# EAGLE design roco1044 (EAGLE 9.5.2)
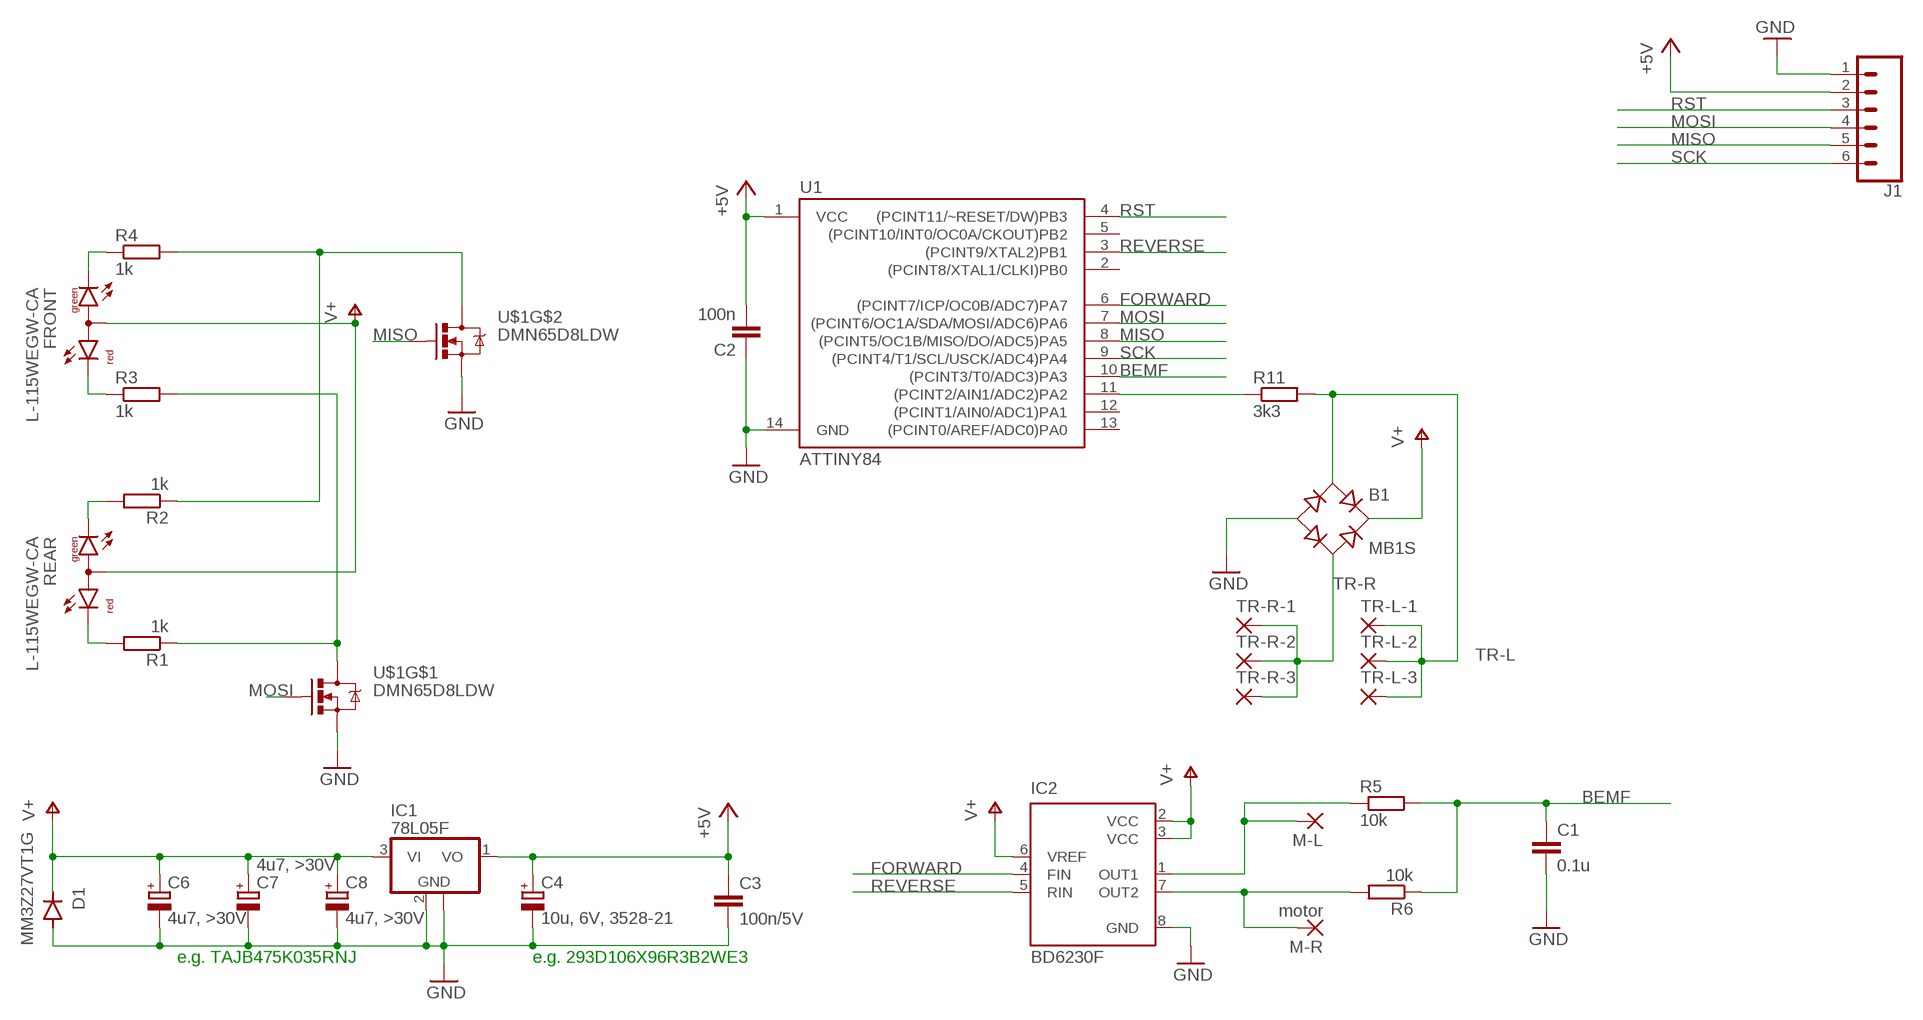
[diagram p0: schematic, sheet 1]

## Parts
B1  MB1S  [SOIC-4]
C1  0.1u  C-EUC0805  [C0805]
C2  100n  C-EUC0805  [C0805]
C3  100n/5V  C-EUC0805  [C0805]
C4  10u, 6V, 3528-21  CPOL-EUCT3528  [CT3528]
C6  4u7, >30V  CPOL-EUCT3528  [CT3528]
C7  4u7, >30V  CPOL-EUCT3528  [CT3528]
C8  4u7, >30V  CPOL-EUCT3528  [CT3528]
D1  MM3Z27VT1G  DIODE-SOD323-R  [SOD323-R]
FRONT  L-115WEGW-CA  [DUOLED-A-3MM]
IC1  78L05F  [SOT89]
IC2  BD6230F  [SOP8]
J1  CONN_061.27MM  [1X06_1.27MM]
M-L  SMD5  [SMD2,54-5,08]
M-R  motor  SMD5  [SMD2,54-5,08]
R1  1k  R-EU_R0603  [R0603]
R2  1k  R-EU_R0603  [R0603]
R3  1k  R-EU_R0603  [R0603]
R4  1k  R-EU_R0603  [R0603]
R5  10k  R-EU_R0603  [R0603]
R6  10k  R-EU_R0603  [R0603]
R11  3k3  R-EU_R0603  [R0603]
REAR  L-115WEGW-CA  [DUOLED-A-3MM]
TR-L-1  SMD5  [SMD2,54-5,08]
TR-L-2  SMD5  [SMD2,54-5,08]
TR-L-3  SMD5  [SMD2,54-5,08]
TR-R-1  SMD5  [SMD2,54-5,08]
TR-R-2  SMD5  [SMD2,54-5,08]
TR-R-3  SMD5  [SMD2,54-5,08]
U1  ATTINY84  [SO14]
U$1  DMN65D8LDW  [SOT363]

## Nets
+5V: C2.2 C3.1 C4.+ IC1.1(VO) J1.2 U1.1(VCC)
BEMF: C1.1 R5.2 R6.1 U1.10((PCINT3/T0/ADC3)PA3)
FORWARD: IC2.4(FIN) U1.6((PCINT7/ICP/OC0B/ADC7)PA7)
GND: B1.- C1.2 C2.1 C3.2 C4.- C6.- C7.- C8.- D1.A IC1.2(GND) IC1.2@1(GND) IC2.8(GND) J1.1 U1.14(GND) U$1.P$3(S) U$1.P$6(S)
MISO: J1.5 U1.8((PCINT5/OC1B/MISO/DO/ADC5)PA5) U$1.P$5(G)
MOSI: J1.4 U1.7((PCINT6/OC1A/SDA/MOSI/ADC6)PA6) U$1.P$2(G)
N$4: IC2.7(OUT2) M-R.1(P) R6.2
N$5: R2.1 R4.2 U$1.P$1(D)
N$6: R1.2 REAR.3(CR)
N$7: R2.2 REAR.1(CG)
N$8: R1.1 R3.2 U$1.P$4(D)
N$9: FRONT.3(CR) R3.1
N$10: FRONT.1(CG) R4.1
N$11: IC2.1(OUT1) M-L.1(P) R5.1
N$12: R11.1 U1.11((PCINT2/AIN1/ADC2)PA2)
REVERSE: IC2.5(RIN) U1.3((PCINT9/XTAL2)PB1)
RST: J1.3 U1.4((PCINT11/~RESET/DW)PB3)
SCK: J1.6 U1.9((PCINT4/T1/SCL/USCK/ADC4)PA4)
TR-L: B1.~1(AC1) R11.2 TR-L-1.1(P) TR-L-2.1(P) TR-L-3.1(P)
TR-R: B1.~2(AC2) TR-R-1.1(P) TR-R-2.1(P) TR-R-3.1(P)
V+: B1.+ C6.+ C7.+ C8.+ D1.C FRONT.2(A) IC1.3(VI) IC2.2(VCC) IC2.3(VCC) IC2.6(VREF) REAR.2(A)
Unconnected: U1.2((PCINT8/XTAL1/CLKI)PB0) U1.5((PCINT10/INT0/OC0A/CKOUT)PB2) U1.12((PCINT1/AIN0/ADC1)PA1) U1.13((PCINT0/AREF/ADC0)PA0)

## Notes on the sheet
- e.g. TAJB475K035RNJ | e.g. 293D106X96R3B2WE3

## Library data of the parts
B1 = rectifier:MB*S: Bridge Rectifier Source: http://www.fairchildsemi.com/ds/MB/MB6S.pdf
C1 = resistor:C-EU: CAPACITOR, European symbol
C2 C3 = rcl:C-EU: CAPACITOR, European symbol; SPICEPREFIX: C
C4 C6-C8 = rcl:CPOL-EU: POLARIZED CAPACITOR, European symbol; SPICEPREFIX: C
D1 = diode:DIODE-: DIODE
FRONT REAR = led:L-115WEGW-CA: T-1(3mm) BI-COLOR INDICATOR LAMP Source: Kingbright .. 2_colour_led_.pdf
IC1 = linear:78L*: POSITOIV-VOLTAGE REGULATORS Output up to 100 mA Source: Datasheet <http://focus.ti.com/lit/ds/symlink/ua78l05.pdf>
IC2 = rohm:BD623*F: H-bridge driver for brush motors Source: http://www.rohm.com/products/databook/motor/pdf/bd623x_series-e.pdf; MPN: BD6230F-E2; OC_FARNELL: 1716264; OC_NEWARK: 15R0529
J1 = SparkFun-Connectors:CONN_06: Multi connection point. Often used as Generic Header-pin footprint for 0.1 inch spaced/style header connections On any of the 0.1 inch spaced packages, you can populate with these: Break Away Headers - Straight <https://www.sparkfun.com/products/116> (PRT-00116) Break Away Male Headers - Right Angle <https://www.sparkfun.com/products/553> (PRT-00553) Female Headers <https://www.sparkfun.com/products/115> (PRT-00115) Break Away Headers - Machine Pin <https://www.sparkfun.com/products/117> (PRT-00117) Break Away Female Headers - Swiss Machine Pin <https://www.sparkfun.com/products/743> (PRT-00743) Arduino Stackable Header - 6 Pin <https://www.sparkfun.com/products/9280> (PRT-09280) For SCREWTERMINALS and SPRING TERMINALS visit here: Screw Terimnals on SparkFun.com <https://www.sparkfun.com/search/results?term=Screw+Terminals> (5mm/3.5mm/2.54mm spacing) This device is also useful as a general connection point to wire up your design to another part of your project. Our various solder wires solder well into these plated through hole pads. Hook-Up Wire - Assortment (Stranded, 22 AWG) <https://www.sparkfun.com/products/11375> (PRT-11375) Hook-Up Wire - Assortment (Solid Core, 22 AWG) <https://www.sparkfun.com/products/11367> (PRT-11367) View the entire wire category on our website here <https://www.sparkfun.com/categories/141>
M-L M-R TR-L-1-TR-L-3 TR-R-1-TR-R-3 = wirepad:SMD5: SMD PAD
R1-R6 R11 = rcl:R-EU_: RESISTOR, European symbol; SPICEPREFIX: R
U1 = SparkFun-IC-Microcontroller:ATTINY84: Atmel 14-pin 2/4/8kB flash uC Datasheet <https://cdn.sparkfun.com/datasheets/Widgets/doc8006.pdf> SparkFun Products Tiny AVR Programmer <https://www.sparkfun.com/products/11801> (PGM-11801) SparkFun Servo Trigger - Continuous Rotation <https://www.sparkfun.com/products/13872> (WIG-13872) SparkFun Servo Trigger <https://www.sparkfun.com/products/13118> (WIG-13118); PROD_ID: IC-11285
U$1 = Railstars:DMN65D8LDW

## Board
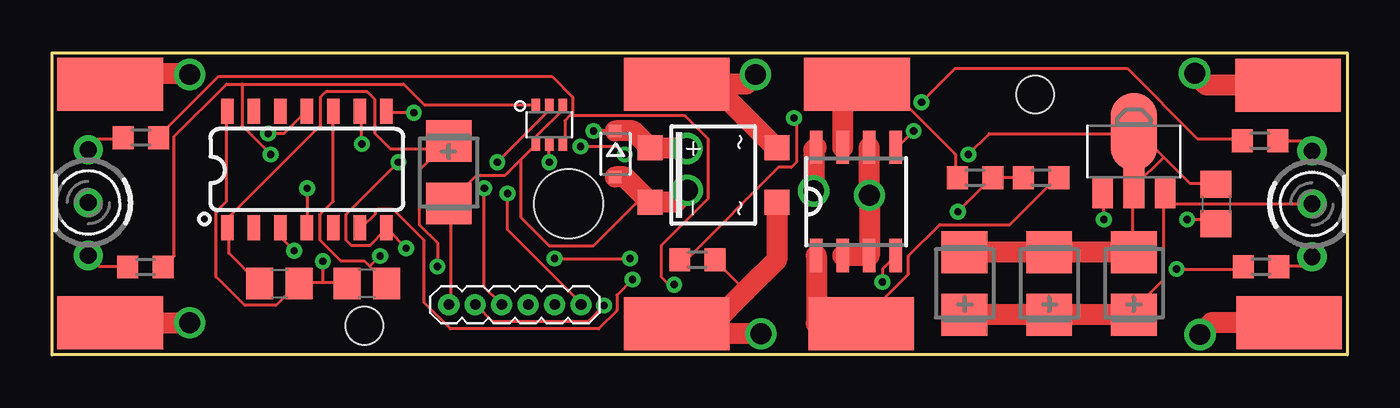
[diagram p1: board, top side]
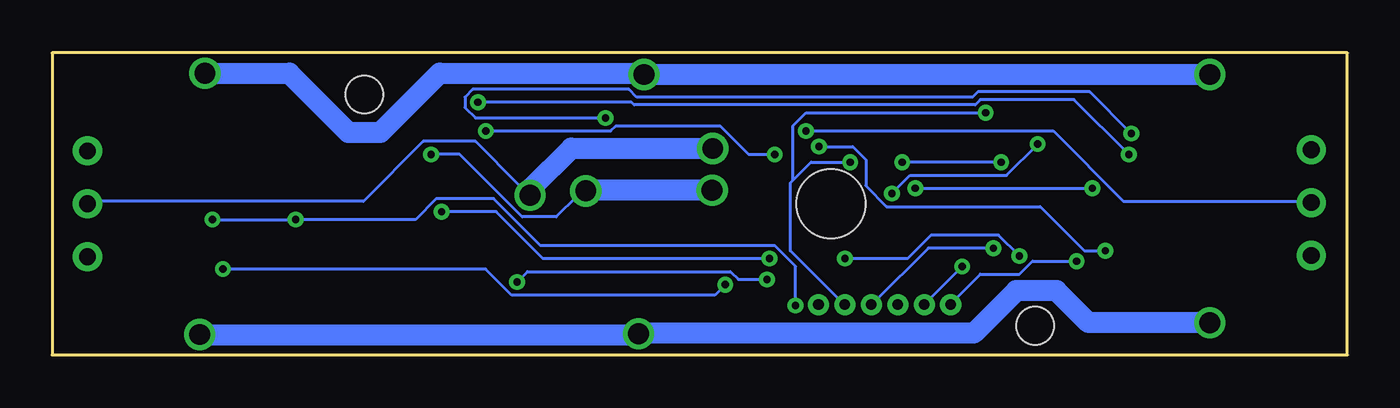
[diagram p2: board, bottom side, seen from below]

Size 62.2 x 14.5 mm. Coordinates in mm from the lower left corner, seen from the top.
Outline: 0,0 0,14.5 62.2,14.5 62.2,0 0,0
Copper layers (1*16): Top 0.035mm / dielectric 1.5mm / Bottom 0.035mm
Design rules "default *": minimum track width 6mil, minimum drill 0.3mm, track to track 6mil, track to pad 6mil, pad to pad 6mil, via to via 6mil, smd to smd 6mil, copper to edge 6mil, drill to drill 6mil, minimum pad ring 10mil, minimum via ring 8mil, stop-mask expansion 4mil, vias tented up to drill 0mil, thermal gap 10mil
Holes 1.8 mm at 15,1.4 47.2,12.5
Holes 3.3 mm at 24.8,7.25

### Footprints (pad centres in the part's own frame; a part is rotated, then mirrored left to right if it is on the bottom)
SOIC-4 = smd 1.2 x 1.2: + 1.3,3.05; - -1.3,3.05; ~1 -1.3,-3.05; ~2 1.3,-3.05
C0805 = smd 1.3 x 1.5: 1 -0.95,0; 2 0.95,0
CT3528 = smd 2 x 2.2: + -1.5,0; - 1.5,0
SOD323-R = smd 0.6 x 0.6: A 1.1,0; C -1.1,0
DUOLED-A-3MM = drill 0.8 pad 1.4: 1 -2.54,0; 2 0,0; 3 2.54,0
SOT89 = smd 1 x 1.5: 1 -1.499,-1.981; 3 1.499,-1.981 | smd 1 x 2: 2 0,-1.727 | smd 2.2 x 3.7: 2@1 0,0.94
SOP8 = smd 0.6 x 1.6: 1 -1.905,-2.6; 2 -0.635,-2.6; 3 0.635,-2.6; 4 1.905,-2.6; 5 1.905,2.6; 6 0.635,2.6; 7 -0.635,2.6; 8 -1.905,2.6
1X06_1.27MM = drill 0.508 pad 1: 1 0,0; 2 1.27,0; 3 2.54,0; 4 3.81,0; 5 5.08,0; 6 6.35,0
SMD2,54-5,08 = smd 2.54 x 5.08: 1 0,0
R0603 = smd 1 x 1.1: 1 -0.85,0; 2 0.85,0
SO14 = smd 0.6 x 1.2: 1 -3.175,-2.8; 2 -1.905,-2.8; 3 -0.635,-2.8; 4 0.635,-2.8; 5 1.905,-2.8; 6 3.175,-2.8; 7 4.445,-2.8; 8 4.445,2.8; 9 3.175,2.8; 10 1.905,2.8; 11 0.635,2.8; 12 -0.635,2.8; 13 -1.905,2.8; 14 -3.175,2.8
SOT363 = smd 0.42 x 0.6: P$1 -0.65,0.95; P$2 0,0.95; P$3 0.65,0.95; P$4 0.65,-0.95; P$5 0,-0.95; P$6 -0.65,-0.95

### Placement (x,y rotation side)
B1  31.75,8.64 90 top
C1  15.11,3.43 180 top
C2  55.88,7.24 270 top
C3  10.92,3.43 0 top
C4  19.05,8.76 270 top
C6  43.81,3.43 90 top
C7  47.88,3.43 90 top
C8  51.94,3.43 90 top
D1  27.05,9.65 270 top
FRONT  1.74,7.31 90 top
IC1  51.94,9.78 0 top
IC2  38.61,7.37 0 top
J1  19.05,2.41 0 top
M-L  38.85,1.5 90 top
M-R  38.65,13 90 top
R1  58.05,4.23 0 top
R2  58.01,10.28 0 top
R3  4.27,10.43 0 top
R4  4.48,4.22 0 top
R5  47.5,8.51 180 top
R6  44.32,8.51 180 top
R11  30.99,4.57 0 top
REAR  60.5,7.25 270 top
TR-L-1  2.8,1.55 90 top
TR-L-2  59.4,1.55 90 top
TR-L-3  30,1.5 270 top
TR-R-1  2.8,13 90 top
TR-R-2  59.35,12.95 270 top
TR-R-3  30,13 90 top
U1  11.6,8.9 0 top
U$1  23.88,11.05 0 top

### Tracks (layer width: path | path; a pad name or v marks a point on that pad's centre or on a via)
+5V  (via drill 0.35)
  Top 0.152: v50.5,6.5 50.5,7.75 IC1.1 | v54.5,6.5 55.75,6.5 55.88,6.38 C2.2 | C3.1 9.88,3.5 8.5,4.88 8.5,6 U1.1 8.5,6.12 8.5,6.62 12.88,11 12.88,12.38 13.12,12.62 15.12,12.62 15.5,12.25 15.5,10.62 16.24,9.88 18.62,9.88 | v18.5,4.25 18.5,5.38 17.62,6.25 17.62,8.88 18.62,9.88 | 18.62,9.88 19,10.25 C4.+ 18.62,9.88 | v26.5,2.38 25.75,1.62 21.12,1.62 20.38,2.38 J1.2
  Bottom 0.152: v54.5,6.5 v50.5,6.5 44.75,6.5 43.75,7.5 41,7.5 38.75,5.25 27.5,5.25 26.5,4.25 v26.5,2.38 | v18.5,4.25 20.25,2.5 J1.2
BEMF  (via drill 0.35)
  Top 0.152: R5.2 46.62,8.5 45.25,8.5 R6.1 45.12,8.5 v43.5,6.88 | 15.25,4.25 16,3.5 C1.1 | 15.25,4.25 15,4.5 13.88,4.5 12.88,5.5 12.88,6.75 13.5,7.38 13.5,11.62 U1.10 | v24.12,4.62 v27.75,4.62 | 15.25,4.25 v15.75,4.75
  Bottom 0.152: v43.5,6.88 40.88,6.88 38.62,4.62 v27.75,4.62 | v24.12,4.62 21.12,4.62 20,5.75 16.75,5.75 v15.75,4.75
FORWARD  (via drill 0.35)
  Top 0.152: v27.88,3.62 27.12,2.88 27.12,2.12 26.25,1.25 19.12,1.25 17.88,2.5 17.88,5.5 16.38,7 15.62,7 15.5,6.88 15.5,6.75 14.88,6.12 U1.6 | v39.88,3.5 39.88,4.12 40.5,4.75 IC2.4
  Bottom 0.152: v27.88,3.62 29.25,3.62 29.62,4 39.38,4 v39.88,3.5
GND  (via drill 0.35, 1)
  Top 0.152: U1.14 8.38,11.62 8.38,7.38 7.88,6.88 7.88,3.75 9.25,2.38 10.75,2.38 11.75,3.38 C3.2 11.88,3.5 13,3.5 | 13,3.5 14.12,3.5 C1.2 | 53.38,9.5 52.25,10.62 52,10.62 IC1.2@1 51.88,10.62 45,10.62 v44,9.62 | 53.38,9.5 54.62,8.25 55.88,8.25 C2.1 | 53.38,9.5 52,8.12 IC1.2 51.88,8 51.88,5.38 C8.- | U$1.P$3 24.62,11.88 23.25,10.5 23.25,10.12 U$1.P$6 23.12,10 22.5,9.38 | 22.5,9.38 21.75,8.62 20.38,8.62 19.12,7.38 C4.- 19.12,7.25 19.12,2.5 J1.1 | 28.4,7.64 26.01,5.25 23.87,5.25 22.5,6.62 22.5,9.38 | v13,4.5 13,3.5
  Top 1.016: IC2.8 36.58,9.84 v36.58,7.87 | v30.5,7.9 29.94,7.34 B1.- 28.4,7.64 27.48,8.55 D1.A | C8.- C7.- C6.-
  Bottom 0.152: v44,9.62 42.62,9.62 39.62,6.62 38,6.62 37,7.62 v36.58,7.87 | v13,4.5 15.12,4.5 15.75,3.88 17.62,3.88 19,2.5 J1.1
  Bottom 1.016: v30.5,7.9 30.53,7.92 36.52,7.92 v36.58,7.87
MISO  (via drill 0.35)
  Top 0.152: v23.88,9.25 23.88,10 U$1.P$5 | v17.38,11.62 16.12,11.62 U1.8
  Bottom 0.152: v23.88,9.25 25.75,9.25 26.62,8.38 | 26.62,8.38 26.75,8.25 26.75,5 24.25,2.5 J1.5 | v17.38,11.62 26,11.62 26.62,11 26.62,8.38
MOSI  (via drill 0.35)
  Top 0.152: v21.38,9.25 23.88,11.75 23.88,11.88 U$1.P$2 | v16.62,9.25 14.12,6.75 14.12,5.5 14.38,5.25 15.25,5.25 16,6 U1.7 16.12,6 v17,5.12
  Bottom 0.152: v16.62,9.25 v21.38,9.25 | v17,5.12 20.12,5.12 22.75,2.5 J1.4
N$4
  Top 0.152: R6.2 43.38,8.62 43.38,9.62 40.12,12.88 39.12,12.88 M-R.1
  Top 1.016: IC2.7 37.97,12.95 38.02,13 M-R.1
N$5  (via drill 0.35)
  Top 0.152: 9.12,13 8.38,13 5.88,10.5 5.88,4.75 5.38,4.25 R4.2 | 9.12,13 16.88,13 17.88,12 23.12,12 U$1.P$1 | v41.75,12.12 43.38,13.75 51.62,13.75 55,10.38 57.12,10.38 R2.1 | v10.5,9.62 9.12,11 9.12,13
  Bottom 0.152: v41.75,12.12 34.38,12.12 34.25,12 17.88,12 17.62,12.25 13.12,12.25 v10.5,9.62
N$6
  Top 0.152: R1.2 59,4.25 60.12,4.25 60.5,4.62 REAR.3
N$7
  Top 0.152: R2.2 58.88,10.25 60.12,10.25 60.5,9.88 REAR.1
N$8  (via drill 0.35)
  Top 0.152: 24.88,11.5 25,11.62 25,12.38 24,13.38 8,13.38 5.12,10.5 R3.2 | 24.88,11.5 24.62,11.25 24.62,10.12 U$1.P$4 | v54,4.12 57.12,4.12 R1.1 | v29.88,3.38 29.62,3.38 29.25,3.75 29.25,5.25 31.5,7.5 31.5,10.38 30.38,11.5 24.88,11.5
  Bottom 0.152: v54,4.12 41.38,4.12 40.12,2.88 30.38,2.88 v29.88,3.38
N$9
  Top 0.152: R3.1 3.38,10.38 2.25,10.38 1.75,9.88 FRONT.3
N$10
  Top 0.152: R4.1 3.62,4.25 2.25,4.25 1.75,4.75 FRONT.1
N$11
  Top 0.152: R5.1 48.25,8.5 46,6.25 42.62,6.25 41.12,4.75 41.12,3.88 39.12,1.88 M-L.1
  Top 1.016: IC2.1 36.7,1.5 M-L.1
N$12  (via drill 0.35)
  Top 0.152: v35.62,11.38 35.75,11.25 35.75,9.25 35.5,9 34.88,9 30.5,4.62 30.25,4.62 R11.1 | v10.38,10.62 11.12,10.62 12.12,11.62 U1.11
  Bottom 0.152: v35.62,11.38 41.88,11.38 42.38,11.88 42.38,12.38 42,12.75 34.5,12.75 34.12,12.38 18,12.38 17.75,12.62 12.38,12.62 v10.38,10.62
REVERSE  (via drill 0.35)
  Top 0.152: v11.62,5 11,5.62 11,6 U1.3 | v25.38,10 27.12,10 v27.5,9.62 | v41.38,10.75 40.62,10 IC2.5
  Bottom 0.152: v11.62,5 12.62,5 14.75,7.12 22.12,7.12 23.12,8.12 23.12,9.38 23.75,10 v25.38,10 | v27.5,9.62 28.75,9.62 30.12,11 35.12,11 35.38,10.75 v41.38,10.75
RST  (via drill 0.35)
  Top 0.152: v12.25,8 12.25,6.12 U1.4 | v20.75,8 20.75,3.25 21.5,2.5 J1.3
  Bottom 0.152: v20.75,8 v12.25,8
SCK  (via drill 0.35)
  Top 0.152: v14.88,10.12 14.88,11.62 U1.9 | v21.88,7.75 21.88,6 25.38,2.5 J1.6
  Bottom 0.152: v14.88,10.12 16.38,8.62 21,8.62 v21.88,7.75
TR-L  (via drill 1)
  Top 0.152: 33.3,3.07 31.88,4.5 R11.2
  Top 1.016: B1.~1 34.8,4.57 33.3,3.07 31.73,1.5 TR-L-3.1 30.48,1.02 v34.04,1.02 | v55.12,0.98 55.69,1.55 TR-L-2.1 | TR-L-1.1 v6.6,1.55
  Bottom 1.016: v55.12,0.98 34.04,0.98 | 34.04,0.98 v34.04,1.02 | v6.6,1.55 12.44,1.55 13.97,3.09 15.9,3.09 17.95,1.04 33.97,1.04 34.04,0.98
TR-R  (via drill 1)
  Top 1.016: B1.~2 34.77,9.94 31.7,13 TR-R-3.1 33.32,13 v33.78,13.46 | v54.86,13.52 55.44,12.95 TR-R-2.1 | v6.6,13.46 6.56,13.51 3.31,13.51 TR-R-1.1
  Bottom 1.016: v54.86,13.52 50.81,13.52 47.97,10.69 46.43,10.69 43.59,13.52 33.78,13.52 v33.78,13.46 v6.6,13.46
V+  (via drill 0.35, 1)
  Top 0.152: 53.38,7.25 53.38,3.62 52.12,2.38 C8.+ | 53.38,7.25 53.38,7.75 IC1.3 53.38,7.25 | 53.38,7.25 REAR.2 | v26,10.75 26.62,10.75 D1.C
  Top 1.016: v30.48,9.91 30.48,9.94 B1.+ 27.88,10.75 D1.C | IC2.6 v39.24,7.67 IC2.3 IC2.2 | C6.+ C7.+ C8.+
  Bottom 0.152: v26,10.75 14.12,10.75 10.75,7.38 1.75,7.38 FRONT.2 | REAR.2 60.5,7.38 47.25,7.38 44.38,10.25 41.88,10.25 39.75,8.12 v39.24,7.67
  Bottom 1.016: v30.48,9.91 30.5,9.93 37.26,9.93 39.24,7.95 v39.24,7.67